# EAGLE design microB (EAGLE 6.3)
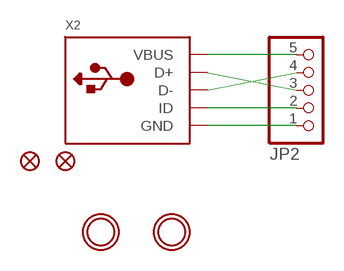
[diagram p0: schematic, sheet 1]

## Parts
FID1  FIDUCIAL""  [FIDUCIAL_1MM]
FID2  FIDUCIAL""  [FIDUCIAL_1MM]
JP2  HEADER-1X570MIL  [1X05_ROUND_70]
U$1  MOUNTINGHOLE2.5  [MOUNTINGHOLE_2.5_PLATED]
U$2  MOUNTINGHOLE2.5  [MOUNTINGHOLE_2.5_PLATED]
X2  USBMICRO_20329  [4UCONN_20329]

## Nets
D+: JP2.3 X2.D+
D-: JP2.4 X2.D-
GND: JP2.1 X2.BASE@1(GND) X2.BASE@2(GND) X2.GND X2.SPRT@1(GND) X2.SPRT@2(GND) X2.SPRT@3(GND) X2.SPRT@4(GND)
ID: JP2.2 X2.ID
VBUS: JP2.5 X2.VBUS

## Library data of the parts
FID1 FID2 = microbuilder:FIDUCIAL: Fiducial Alignment Points Various fiducial points for machine vision alignment.; BOM: EXCLUDE
JP2 = microbuilder:HEADER-1X5: PIN HEADER
U$1 U$2 = microbuilder:MOUNTINGHOLE: Mounting Hole For #2 screws (0.086"/2.18mm width, 0.094"/2.4mm hole) use 2.5mm; BOM: EXCLUDE
X2 = microbuilder:USB: USB Connectors USBMINIB - Surface Mount Female Mini-B USB Connector 4UConnector: 06564

## Board
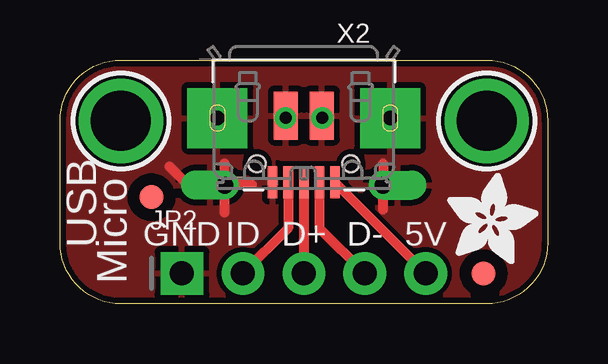
[diagram p1: board, top side]
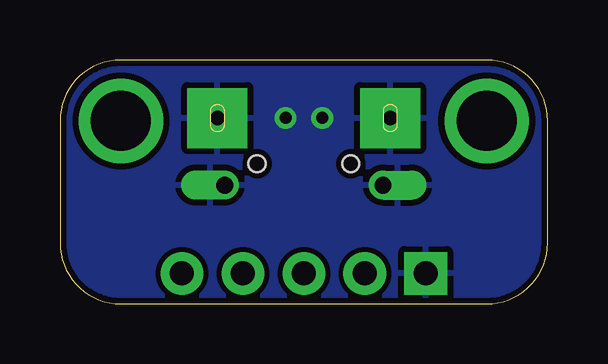
[diagram p2: board, bottom side, seen from below]

Size 20.32 x 10.16 mm. Coordinates in mm from the lower left corner, seen from the top.
Outline: 2.54,10.16 17.78,10.16 arc-90 20.32,7.62 20.32,2.54 arc-90 17.78,0 2.54,0 arc-90 0,2.54 0,7.62 arc-90 2.54,10.16
Copper layers (1*16): Top 0.035mm / dielectric 1.5mm / Bottom 0.035mm
Design rules "default": minimum track width 10mil, minimum drill 16mil, track to track 8mil, track to pad 8mil, pad to pad 8mil, via to via 8mil, smd to smd 8mil, copper to edge 10mil, drill to drill 8mil, minimum pad ring 10mil, minimum via ring 8mil, stop-mask expansion 4mil, vias tented up to drill 20mil, thermal gap 10mil

### Footprints (pad centres in the part's own frame; a part is rotated, then mirrored left to right if it is on the bottom)
FIDUCIAL_1MM = smd 1 x 1: 1 0,0
1X05_ROUND_70 = drill 1 pad 1.778 square: 1 -5.08,0 | drill 1 pad 1.778: 2 -2.54,0; 3 0,0; 4 2.54,0; 5 5.08,0
MOUNTINGHOLE_2.5_PLATED = drill 2.5 pad 3.2: P$1 0,0
4UCONN_20329 = smd 1 x 2: BASE@1 -0.75,-2; BASE@2 0.75,-2 | smd 0.4 x 1.35: D+ 0,0.775; D- -0.65,0.775; GND 1.3,0.775; ID 0.65,0.775; VBUS -1.3,0.775 | drill 0.7 offset: SPRT@1 -3.3,0.9; SPRT@2 3.3,0.9 | drill 0.6 pad 2.5 square: SPRT@3 -3.6,-1.9; SPRT@4 3.6,-1.9 | hole 0.7: -1.95,0; 1.95,0

### Placement (x,y rotation side)
FID1  3.81,4.45 0 top
FID2  17.65,1.27 0 top
JP2  10.16,1.27 0 top
U$1  2.54,7.62 0 top
U$2  17.78,7.62 0 top
U$4  [ADAFRUIT_3.5MM]  16.13,1.65 0 top
X2  10.16,5.84 180 top

### Tracks (layer width: path | path; a pad name or v marks a point on that pad's centre or on a via)
D+
  Top 0.406: X2.D+ JP2.3
D-
  Top 0.406: X2.D- 10.81,3.16 JP2.4
GND  (via drill 0.5)
  Top 0.406: v9.4,7.75 9.4,7.83 X2.BASE@2 | v10.92,7.75 10.92,7.83 X2.BASE@1 | 5.46,5.08 5.21,5.08 4.57,5.71 | 6.86,3.81 6.86,4.7 | 6.86,4.95 6.86,5.84 | 8,4.95 6.99,4.95 | 13.46,5.84 13.46,5.33 | 13.46,3.94 13.46,4.83 13.34,4.95 13.46,5.08 | X2.SPRT@1 13.46,5.08 | 13.46,5.08
  pour Top: -0.13,10.29 0,0 20.32,0 20.19,10.29
  pour Bottom: -0.13,10.41 0,0.13 20.32,0.13 20.19,10.41
ID
  Top 0.406: X2.ID 9.51,3.16 JP2.2
VBUS
  Top 0.406: X2.VBUS 11.46,5.05 JP2.5

### Text on the board
tPlace: USB | Micro | GND | ID | D+ | D- | 5V